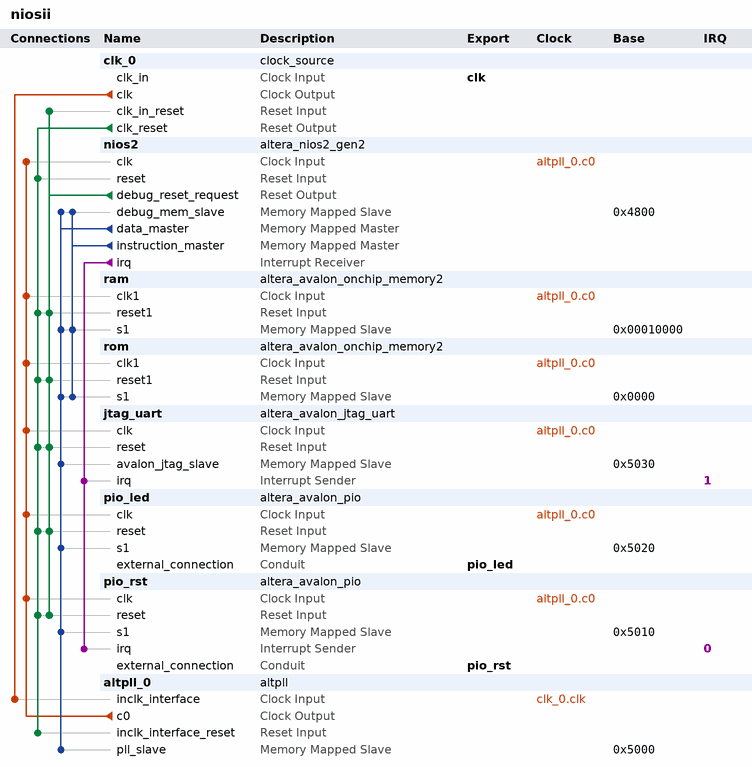
[diagram p0: system contents]
# Platform Designer (Qsys) system niosii, MAX 10 10M08SAM153C8G
# Parameters at their usual value, and those the tool derives, are not listed.
package require -exact qsys 23.1
create_system niosii
set_project_property DEVICE_FAMILY {MAX 10}
set_project_property DEVICE 10M08SAM153C8G

add_instance clk_0 clock_source 23.1
set_instance_parameter_value clk_0 clockFrequency 12000000

add_instance nios2 altera_nios2_gen2 23.1
set_instance_parameter_value nios2 dcache_size 2048
set_instance_parameter_value nios2 exceptionSlave ram.s1
set_instance_parameter_value nios2 icache_size 4096
set_instance_parameter_value nios2 impl Tiny
set_instance_parameter_value nios2 resetSlave rom.s1

add_instance ram altera_avalon_onchip_memory2 23.1
set_instance_parameter_value ram dataWidth 32
set_instance_parameter_value ram dualPort false
set_instance_parameter_value ram initMemContent true
set_instance_parameter_value ram initializationFileName onchip_mem.hex
set_instance_parameter_value ram memorySize 25600

add_instance rom altera_avalon_onchip_memory2 23.1
set_instance_parameter_value rom dataWidth 32
set_instance_parameter_value rom dualPort false
set_instance_parameter_value rom initMemContent true
set_instance_parameter_value rom initializationFileName onchip_mem.hex
set_instance_parameter_value rom memorySize 10240
set_instance_parameter_value rom writable false

add_instance jtag_uart altera_avalon_jtag_uart 23.1
set_instance_parameter_value jtag_uart simInteractiveOptions NO_INTERACTIVE_WINDOWS

add_instance pio_led altera_avalon_pio 23.1
set_instance_parameter_value pio_led direction Output
set_instance_parameter_value pio_led width 8

add_instance pio_rst altera_avalon_pio 23.1
set_instance_parameter_value pio_rst bitClearingEdgeCapReg true
set_instance_parameter_value pio_rst captureEdge true
set_instance_parameter_value pio_rst direction Input
set_instance_parameter_value pio_rst edgeType FALLING
set_instance_parameter_value pio_rst generateIRQ true
set_instance_parameter_value pio_rst irqType EDGE
set_instance_parameter_value pio_rst width 1

add_instance altpll_0 altpll 23.1
set_instance_parameter_value altpll_0 CLK0_DIVIDE_BY 6
set_instance_parameter_value altpll_0 CLK0_MULTIPLY_BY 25
set_instance_parameter_value altpll_0 INCLK0_INPUT_FREQUENCY 83333
set_instance_parameter_value altpll_0 PORT_ARESET PORT_UNUSED
set_instance_parameter_value altpll_0 PORT_LOCKED PORT_UNUSED
set_instance_parameter_value altpll_0 PORT_clk1 PORT_UNUSED
set_instance_parameter_value altpll_0 PORT_clk2 PORT_UNUSED
set_instance_parameter_value altpll_0 PORT_clk3 PORT_UNUSED

# connections
add_connection altpll_0.c0 jtag_uart.clk clock
add_connection altpll_0.c0 nios2.clk clock
add_connection altpll_0.c0 pio_led.clk clock
add_connection altpll_0.c0 pio_rst.clk clock
add_connection altpll_0.c0 ram.clk1 clock
add_connection altpll_0.c0 rom.clk1 clock
add_connection clk_0.clk altpll_0.inclk_interface clock
add_connection clk_0.clk_reset altpll_0.inclk_interface_reset reset
add_connection clk_0.clk_reset jtag_uart.reset reset
add_connection clk_0.clk_reset nios2.reset reset
add_connection clk_0.clk_reset pio_led.reset reset
add_connection clk_0.clk_reset pio_rst.reset reset
add_connection clk_0.clk_reset ram.reset1 reset
add_connection clk_0.clk_reset rom.reset1 reset
add_connection nios2.debug_reset_request clk_0.clk_in_reset reset
add_connection nios2.debug_reset_request jtag_uart.reset reset
add_connection nios2.debug_reset_request pio_led.reset reset
add_connection nios2.debug_reset_request pio_rst.reset reset
add_connection nios2.debug_reset_request ram.reset1 reset
add_connection nios2.debug_reset_request rom.reset1 reset
add_connection nios2.data_master altpll_0.pll_slave avalon
set_connection_parameter_value nios2.data_master/altpll_0.pll_slave baseAddress 0x5000
add_connection nios2.data_master jtag_uart.avalon_jtag_slave avalon
set_connection_parameter_value nios2.data_master/jtag_uart.avalon_jtag_slave baseAddress 0x5030
add_connection nios2.data_master nios2.debug_mem_slave avalon
set_connection_parameter_value nios2.data_master/nios2.debug_mem_slave baseAddress 0x4800
add_connection nios2.data_master pio_led.s1 avalon
set_connection_parameter_value nios2.data_master/pio_led.s1 baseAddress 0x5020
add_connection nios2.data_master pio_rst.s1 avalon
set_connection_parameter_value nios2.data_master/pio_rst.s1 baseAddress 0x5010
add_connection nios2.data_master ram.s1 avalon
set_connection_parameter_value nios2.data_master/ram.s1 baseAddress 0x00010000
add_connection nios2.data_master rom.s1 avalon
set_connection_parameter_value nios2.data_master/rom.s1 baseAddress 0x0000
add_connection nios2.instruction_master nios2.debug_mem_slave avalon
set_connection_parameter_value nios2.instruction_master/nios2.debug_mem_slave baseAddress 0x4800
add_connection nios2.instruction_master ram.s1 avalon
set_connection_parameter_value nios2.instruction_master/ram.s1 baseAddress 0x00010000
add_connection nios2.instruction_master rom.s1 avalon
set_connection_parameter_value nios2.instruction_master/rom.s1 baseAddress 0x0000
add_connection nios2.irq jtag_uart.irq interrupt
set_connection_parameter_value nios2.irq/jtag_uart.irq irqNumber 1
add_connection nios2.irq pio_rst.irq interrupt
set_connection_parameter_value nios2.irq/pio_rst.irq irqNumber 0

# exported interfaces
add_interface clk clock sink
set_interface_property clk EXPORT_OF clk_0.clk_in
add_interface pio_led conduit end
set_interface_property pio_led EXPORT_OF pio_led.external_connection
add_interface pio_rst conduit end
set_interface_property pio_rst EXPORT_OF pio_rst.external_connection

set_interconnect_requirement {$system} qsys_mm.clockCrossingAdapter HANDSHAKE
set_interconnect_requirement {$system} qsys_mm.enableEccProtection FALSE
set_interconnect_requirement {$system} qsys_mm.insertDefaultSlave FALSE
set_interconnect_requirement {$system} qsys_mm.maxAdditionalLatency 1

save_system niosii.qsys
